# EAGLE schematic F1-T12_heater (EAGLE 9.6.1)
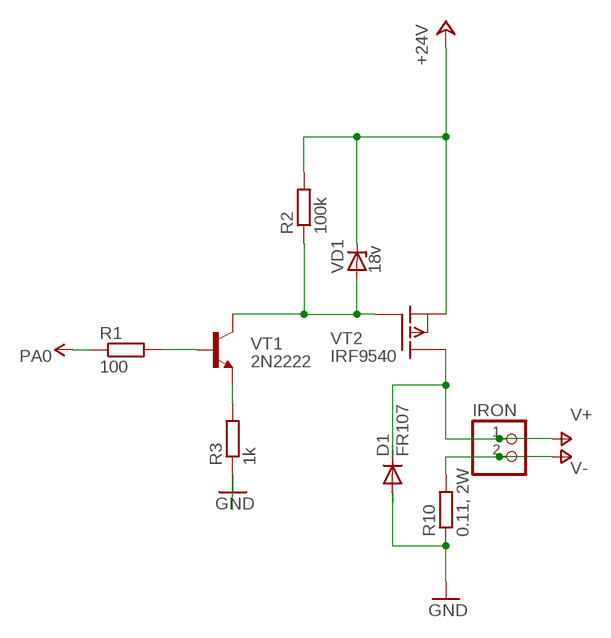
[diagram p0: schematic, sheet 1]

## Parts
D1  FR107  1N4004  [DO41-10]
IRON  PINHD-1X2  [1X02]
R1  100  R-EU_0204/5  [0204/5]
R2  100k  R-EU_0204/5  [0204/5]
R3  1k  R-EU_0204/5  [0204/5]
R10  0.11, 2W  R-EU_0204/5  [0204/5]
VD1  18v  ZENER-DIODEDO34-7  [DO34Z7]
VT1  2N2222  [TO18]
VT2  IRF9540  IRF9530  [TO220]

## Nets
+24V: R2.2 VD1.C VT2.3(S)
GND: D1.A R3.1 R10.1
N$23: R2.1 VD1.A VT1.3(C) VT2.1(G)
N$26: R3.2 VT1.1(E)
N$27: R1.2 VT1.2(B)
V+: D1.C IRON.1 VT2.2(D)
V-: IRON.2 R10.2
VDD: R1.1 ; supply symbol labelled PA0

## Library data of the parts
D1 = diode:1N4004: DIODE general purpose rectifier, 1 A
IRON = pinhead:PINHD-1X2: PIN HEADER
R1-R3 R10 = rcl:R-EU_: RESISTOR, European symbol; SPICEPREFIX: R
VD1 = diode:ZENER-DIODE: Z-Diode
VT1 = transistor:2N2222: NPN TRANSISTOR
VT2 = transistor-fet:IRF9530: P-Channel Enhancement MOSFET (HEXFET); -100V; -12A; 0,3Ohm